# Altium schematic sheet Diode Reverse Recovery Test Circuit.SchDoc
size A4
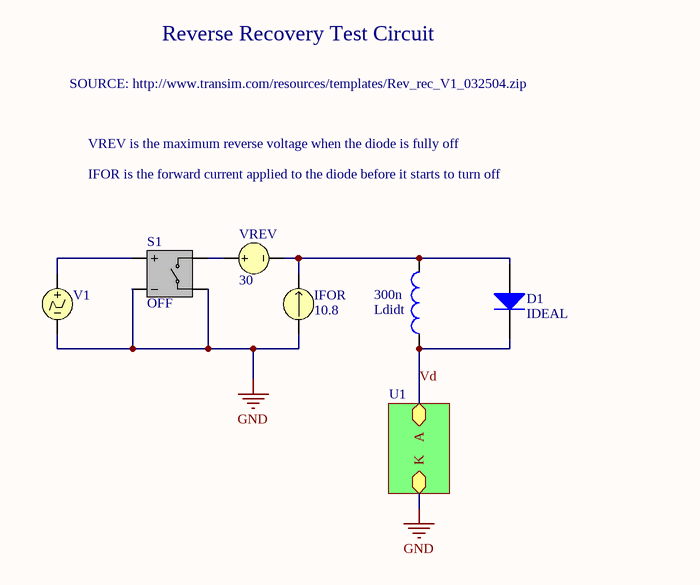
[diagram p0: Diode Reverse Recovery Test Circuit.SchDoc]

## Parts
D1  IDEAL  [SMC]
IFOR  10.8
Ldidt  value 300n  [0402-A]  (hidden comment: Inductor)
S1  Initial Condition: OFF  (hidden comment: VSW)
V1  VPWL  (value not drawn)
VREV  30

## Sub-sheets
U1 = Diode Model: K, A

## Nets
GND: IFOR.1 S1.2(N1-) S1.4(N2-) V1.2 ; sheet U1/K
Vd: D1.2(K) Ldidt.1 ; sheet U1/A
NetD1_1: D1.1(A) IFOR.2 Ldidt.2 VREV.2
NetS1_1: S1.1(N1+) V1.1
NetS1_3: S1.3(N2+) VREV.1

## Notes on the sheet
- SOURCE: http://www.transim.com/resources/templates/Rev_rec_V1_032504.zip
- Reverse Recovery Test Circuit
- VREV is the maximum reverse voltage when the diode is fully off
- IFOR is the forward current applied to the diode before it starts to turn off

## Library data of the parts
D1 = Diode: Default Diode; Published: 8-Jun-2000; LatestRevisionDate: 17-Jul-2002; LatestRevisionNote: Re-released for DXP Platform.; PackageDocument: Sep-1996; PackageReference: SMC; Publisher: Altium Limited; Code_JEDEC: DO-214-AB
IFOR = ISRC: Current Source; Note: PCB Footprint - Not required; Published: 8-Jun-2000; LatestRevisionDate: 17-Jul-2002; LatestRevisionNote: Re-released for DXP Platform.; PackageReference: Not Applicable; Publisher: Altium Limited; Value: 10.8
Ldidt = Inductor: Code_IEC: 1005; Published: 8-Jun-2000; LatestRevisionDate: 17-Jul-2002; LatestRevisionNote: Re-released for DXP Platform.; PackageReference: 0402-A; Publisher: Altium Limited; Code_JEITA: 0402
S1 = VSW: Voltage Controlled Switch; Published: 8-Jun-2000; LatestRevisionDate: 17-Jul-2002; LatestRevisionNote: Re-released for DXP Platform.; PackageReference: Not Applicable; Publisher: Altium Limited
V1 = VPWL: Piecewise Linear Voltage Source; Note: PCB Footprint - Not required; Sim Note: To add model file containing time-current pairs of values, enter model location under "General Tab" in "Full Path" box.; Time-Value Pairs: 0 0 50n 5 1 5; Published: 8-Jun-2000; LatestRevisionDate: 17-Jul-2002; LatestRevisionNote: Re-released for DXP Platform.; PackageReference: Not Applicable; Publisher: Altium Limited
VREV = VSRC: Voltage Source; Note: PCB Footprint - Not required; Published: 8-Jun-2000; LatestRevisionDate: 17-Jul-2002; LatestRevisionNote: Re-released for DXP Platform.; PackageReference: Not Applicable; Publisher: Altium Limited; Value: 30